# Altium schematic sheet StEth32_Base_Power_Output.SchDoc
size A4
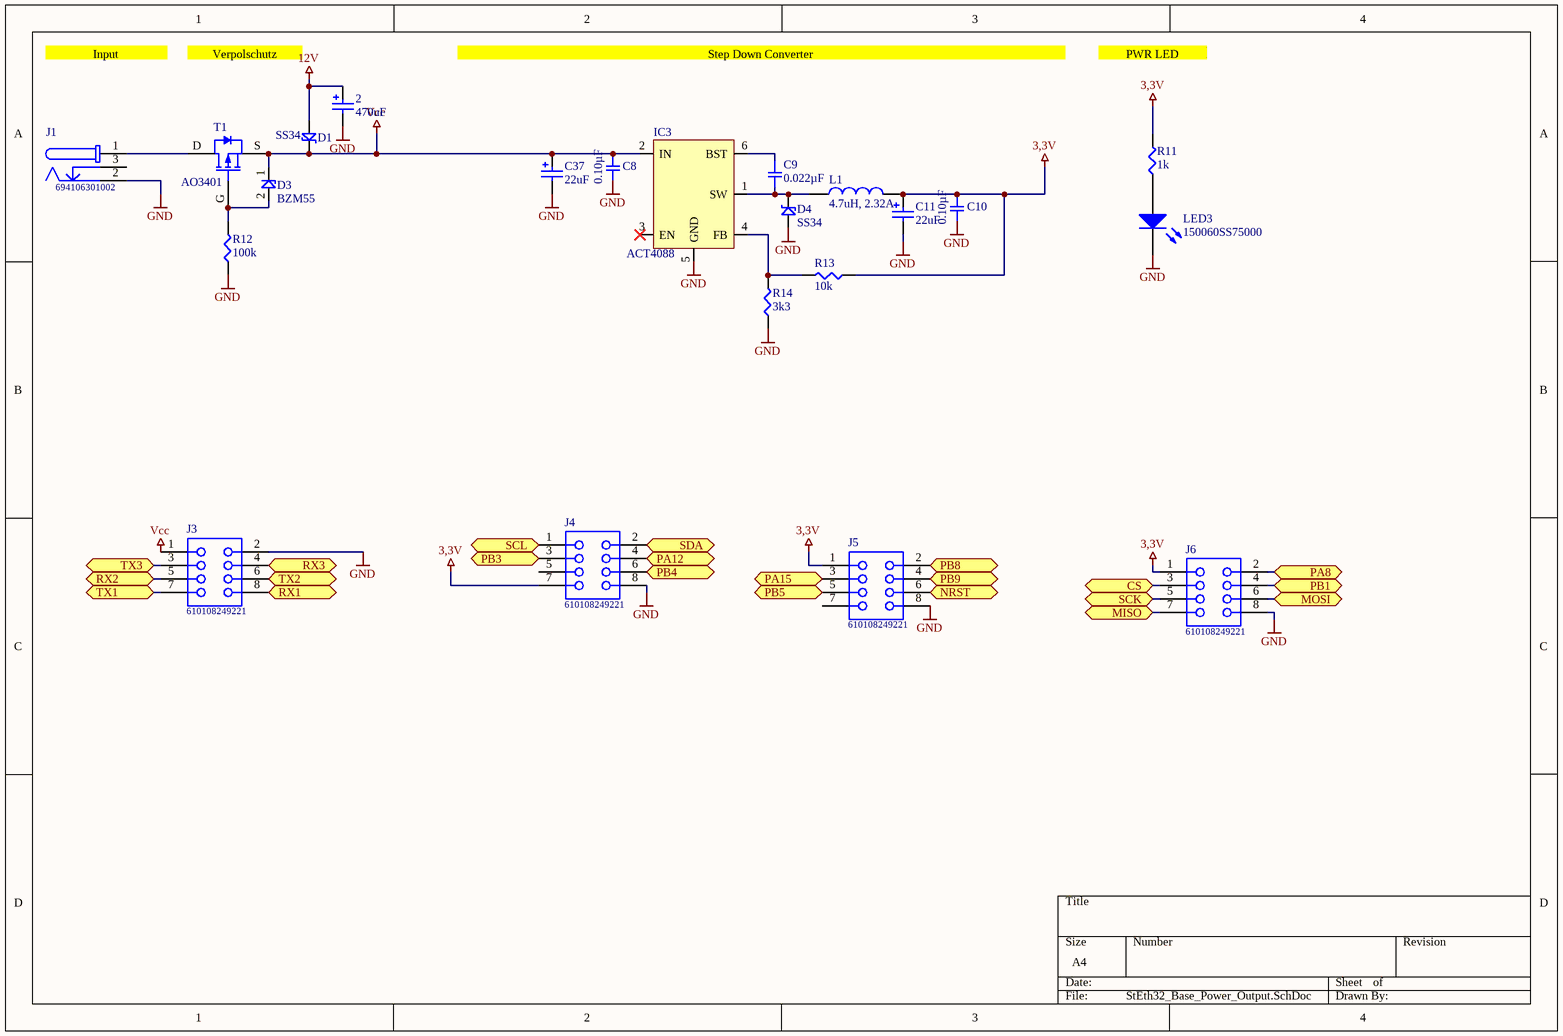
[diagram p0: StEth32_Base_Power_Output.SchDoc]

## Parts
2  value 470uF  [WCAP-ASLI_10x10.5]  (hidden comment: 865080457015)
C8  0.10µF  [SMD-0603C]
C9  0.022µF  [SMD-0603C]
C10  0.10µF  [SMD-0603C]
C11  value 22uF  [WCAP-ASLI_4x5.5]  (hidden comment: 865080140001)
C37  value 22uF  [WCAP-ASLI_4x5.5]  (hidden comment: 865080140001)
D1  SS34  [B240A]
D3  BZM55  [SMD-0603-RES]
D4  SS34  [B240A]
IC3  ACT4088  [SOT23-6]
J1  694106301002  [694106301002]
J3  610108249221  [610108249221]
J4  610108249221  [610108249221]
J5  610108249221  [610108249221]
J6  610108249221  [610108249221]
L1  4.7uH, 2.32A  [WE-PD_7332]
LED3  150060SS75000  [0603_A]
R11  1k  [SMD-0603-RES]
R12  100k  [SMD-0603-RES]
R13  10k  [SMD-0603-RES]
R14  3k3  [SMD-0603-RES]
T1  AO3401  [SOT23]

## Ports
CS (bidir), MISO (bidir), MOSI (bidir), NRST (bidir), PA8 (bidir), PA12 (bidir), PA15 (bidir), PB1 (bidir), PB3 (bidir), PB4 (bidir), PB5 (bidir), PB8 (bidir), PB9 (bidir), RX1 (bidir), RX2 (bidir), RX3 (bidir), SCK (bidir), SCL (bidir), SDA (bidir), TX1 (bidir), TX2 (bidir), TX3 (bidir)

## Nets
3,3V: C10.1 C11.1(P) J4.7 J5.1 J6.1 L1.2 R11.2 R13.1
12V: 2.1(P) D1.A
GND: 2.2(N) C8.2 C10.2 C11.2(N) C37.2(N) D4.A IC3.5(GND) J1.2 J3.2 J4.8 J5.8 J6.8 LED3.1(K) R12.1 R14.1
Vcc: C8.1 C37.1(P) D1.K D3.1 IC3.2(IN) J3.1 T1.S
CS: J6.3 ; port CS
MISO: J6.7 ; port MISO
MOSI: J6.6 ; port MOSI
NRST: J5.6 ; port NRST
PA8: J6.2 ; port PA8
PA12: J4.4 ; port PA12
PA15: J5.3 ; port PA15
PB1: J6.4 ; port PB1
PB3: J4.3 ; port PB3
PB4: J4.6 ; port PB4
PB5: J5.5 ; port PB5
PB8: J5.2 ; port PB8
PB9: J5.4 ; port PB9
RX1: J3.8 ; port RX1
RX2: J3.5 ; port RX2
RX3: J3.4 ; port RX3
SCK: J6.5 ; port SCK
SCL: J4.1 ; port SCL
SDA: J4.2 ; port SDA
TX1: J3.7 ; port TX1
TX2: J3.6 ; port TX2
TX3: J3.3 ; port TX3
NetC9_1: C9.1 IC3.6(BST)
NetC9_2: C9.2 D4.K IC3.1(SW) L1.1
NetD3_2: D3.2 R12.2 T1.G
NetIC3_4: IC3.4(FB) R13.2 R14.2
NetJ1_1: J1.1 T1.D
NetLED3_2: LED3.2(A) R11.1

Not connected (* = marked no-connect by the designer): IC3 3(EN)*; J1 3; J4 5; J5 7

## Notes on the sheet
- Input
- Verpolschutz
- Step Down Converter
- PWR LED

## Library data of the parts
2 = 865080457015: WCAP-ASLI Aluminum Electrolytic Capacitors, size Ф10x10.5mm, 25V DC, 470uF; Rated Voltage: 25V DC; ComponentLink1Description: Manufacturer; ComponentLink1URL: http://www.we-online.de; ComponentLink2Description: Datasheet; ComponentLink2URL: http://katalog.we-online.de/pbs/datasheet/865080457015.pdf; Part Number: 865080457015; Published Date: June 2017; Publisher: Wurth Elektronik; Size: Ф10x10.5mm; Life Cycle: 2000h; Operating Temperature: -55 °C up to +105 °C
C8 C10 = GCM188R71C104KA37J: CAP CER 0.1UF 16V X7R 0603; Manufacturer: Murata Electronics North America; Factory Stock: 0; Unit Price (USD): 0.18; Minimum Quantity: 1; Tolerance: ±10%; Datasheets: http://www.murata.com/~/media/webrenewal/support/library/catalog/products/capacitor/mlcc/c03e.ashx; Image: //media.digikey.com/Renders/Murata%20Renders/0603%28GCM188%29.jpg; Digi-Key Part Number: 490-8015-1-ND; Part Number: GCM188R71C104KA37J; Quantity Available: 17844; @ qty: 0; Packaging: Cut Tape (CT); Series: GCM; Part Status: Active; Value: 0.10µF; Voltage: 16V; Temperature Coefficient: X7R; Operating Temperature: -55°C ~ 125°C; Features: -; Ratings: AEC-Q200; Applications: Automotive; Mounting Type: Surface Mount, MLCC; Package / Case: 0603 (1608 Metric); Size / Dimension: 0.063" L x 0.031" W (1.60mm x 0.80mm); Height - Seated (Max): -; Thickness (Max): 0.035" (0.90mm); Lead Spacing: -; Lead Style: -
C9 = GCJ188R71H223KA01D: CAP CER 0.022UF 50V X7R 0603; Manufacturer: Murata Electronics North America; Factory Stock: 0; Unit Price (USD): 0.22; Minimum Quantity: 1; Tolerance: ±10%; Datasheets: http://www.murata.com/~/media/webrenewal/support/library/catalog/products/capacitor/mlcc/c03e.ashx; Image: //media.digikey.com/Renders/Murata%20Renders/0603%28LQG18%29.jpg; Digi-Key Part Number: 490-5851-1-ND; Part Number: GCJ188R71H223KA01D; Quantity Available: 7651; @ qty: 0; Packaging: Cut Tape (CT); Series: GCJ; Part Status: Active; Value: 0.022µF; Voltage: 50V; Temperature Coefficient: X7R; Operating Temperature: -55°C ~ 125°C; Features: Soft Termination; Ratings: AEC-Q200; Applications: Automotive, Boardflex Sensitive; Mounting Type: Surface Mount, MLCC; Package / Case: 0603 (1608 Metric); Size / Dimension: 0.063" L x 0.031" W (1.60mm x 0.80mm); Height - Seated (Max): -; Thickness (Max): 0.031" (0.80mm); Lead Spacing: -; Lead Style: -
C11 C37 = 865080140001: WCAP-ASLI Aluminum Electrolytic Capacitors, size Ф4x5.5mm, 6.3V DC, 22uF; Rated Voltage: 6.3V DC; ComponentLink1Description: Manufacturer; ComponentLink1URL: http://www.we-online.de; ComponentLink2Description: Datasheet; ComponentLink2URL: http://katalog.we-online.de/pbs/datasheet/865080140001.pdf; Part Number: 865080140001; Published Date: June 2017; Publisher: Wurth Elektronik; Size: Ф4x5.5mm; Life Cycle: 2000h; Operating Temperature: -55 °C up to +105 °C
D1 D4 = B240A: Shottkydiode
J1 = 694106301002: DC Power Jack Connector WR-DC, Male, Right Angled, THT, 5 A, 24 V; Opening Diameter: 6.4 mm; Plug Inner Diameter: 2.05 mm; Plug Outer Diameter: 5.5 mm; Rated Current: 5 A; Working Voltage: 24 V; ComponentLink1Description: Manufacturer; ComponentLink1URL: http://www.we-online.de; ComponentLink2Description: Datasheet; ComponentLink2URL: http://katalog.we-online.de/em/datasheet/6941xx301002.pdf; Part Number: 694106301002; Published Date: August 2018; Publisher: Wurth Elektronik; Orientation: Right Angled; Operating Temperature: -40 to 85 degC; Mounting Technology: THT; Gender: Male; Packaging: Bag
J3-J6 = 610108249221: WR-PHD Socket Header, SMT, pitch 2.54mm, Dual Row, Angled, 8pin; Pin Number: 8; Gender: Female; Rated Current: 3A; Working Voltage: 250VAC; Withstanding Voltage: 600VAC; Contact Resistance: 20mOhm; ComponentLink1Description: Manufacturer; ComponentLink1URL: http://www.we-online.de; ComponentLink2Description: Datasheet; ComponentLink2URL: https://katalog.we-online.de/em/datasheet/6101xx249221.pdf; Part Number: 610108249221; Published Date: June 2019; Publisher: Wurth Elektronik; Pitch: 2.54mm; Operating Temperature: -40 to +105degC; Mounting Technology: SMT; Packaging: Tape and Reel; Row Number: Dual; Orientation: Angled
L1 = 744778004: WE-PD SMT Power Inductor, size 7332, 4.7uH, 2.32A; DC Resistance max.: 60mOhm; Self Resonant Frequency: 45MHz; Saturation Current: 4.2A; ComponentLink1Description: Manufacturer; ComponentLink1URL: http://www.we-online.de; ComponentLink2Description: Datasheet; ComponentLink2URL: https://katalog.we-online.com/pbs/datasheet/744778004.pdf; Part Number: 744778004; Published Date: April 2019; Publisher: Wurth Elektronik; Rated Current: 2.32A; Size: 7332; Inductance: 4.7uH; Operating Temperature: -40 to +125degC; Mounting Technology: SMT; Packaging: Tape and Reel
LED3 = 150060SS75000: SMD mono-color Chip LED, WL-SMCW, Super Red; PackageReference: 0603_A; Color: Super Red; PartNumber: 150060SS75000; ComponentLink1Description: Manufacturer URL; ComponentLink1URL: http://www.we-online.com; ComponentLink2Description: Datasheet; ComponentLink2URL: http://katalog.we-online.com/led/datasheet/150060SS75000.pdf
R11 R13 R14 = ERJ-3EKF1001V: RES SMD 1K OHM 1% 1/10W 0603; Manufacturer: Panasonic Electronic Components; Factory Stock: 0; Unit Price (USD): 0.00379; @ qty: 1500; Minimum Quantity: 1; Power (Watts): 0.1W, 1/10W; Temperature Coefficient: ±100ppm/°C; Part Number: ERJ-3EKF1001V; Datasheets: http://industrial.panasonic.com/www-cgi/jvcr13pz.cgi?E+PZ+3+AOA0002+ERJ3EKF1001V+7+WW; Image: //media.digikey.com/Photos/Panasonic%20Photos/MFG_ERJ-P6W%20Series.jpg; Digi-Key Part Number: P1.00KHCT-ND; Quantity Available: 5218845; Packaging: Cut Tape (CT); Series: ERJ; Part Status: Active; Tolerance: ±1%; Composition: Thick Film; Features: Automotive AEC-Q200; Operating Temperature: -55°C ~ 155°C; Package / Case: 0603 (1608 Metric); Supplier Device Package: 0603; Size / Dimension: 0.063" L x 0.031" W (1.60mm x 0.80mm); Height - Seated (Max): 0.022" (0.55mm); Number of Terminations: 2; Failure Rate: -
  R11: Value: 1k
  R13: Value: 10k
  R14: Value: 3k3
R12 = ERJ-3EKF4701V: RES SMD 4.7K OHM 1% 1/10W 0603; Manufacturer: Panasonic Electronic Components; Factory Stock: 0; Unit Price (USD): 0.00379; @ qty: 1500; Minimum Quantity: 1; Power (Watts): 0.1W, 1/10W; Temperature Coefficient: ±100ppm/°C; Part Number: ERJ-3EKF4701V; Datasheets: http://industrial.panasonic.com/www-cgi/jvcr13pz.cgi?E+PZ+3+AOA0002+ERJ3EKF4701V+7+WW; Image: //media.digikey.com/Photos/Panasonic%20Photos/MFG_ERJ-P6W%20Series.jpg; Digi-Key Part Number: P4.70KHCT-ND; Quantity Available: 999380; Packaging: Cut Tape (CT); Series: ERJ; Part Status: Active; Value: 100k; Tolerance: ±1%; Composition: Thick Film; Features: Automotive AEC-Q200; Operating Temperature: -55°C ~ 155°C; Package / Case: 0603 (1608 Metric); Supplier Device Package: 0603; Size / Dimension: 0.063" L x 0.031" W (1.60mm x 0.80mm); Height - Seated (Max): 0.022" (0.55mm); Number of Terminations: 2; Failure Rate: -
T1 = AO3401: AO3401 MOSFET 30V